# EAGLE schematic axiom_beta_main_board_v0.27_test.fcc74ab7 (EAGLE 7.7.0)

## Sheet 1 of 6
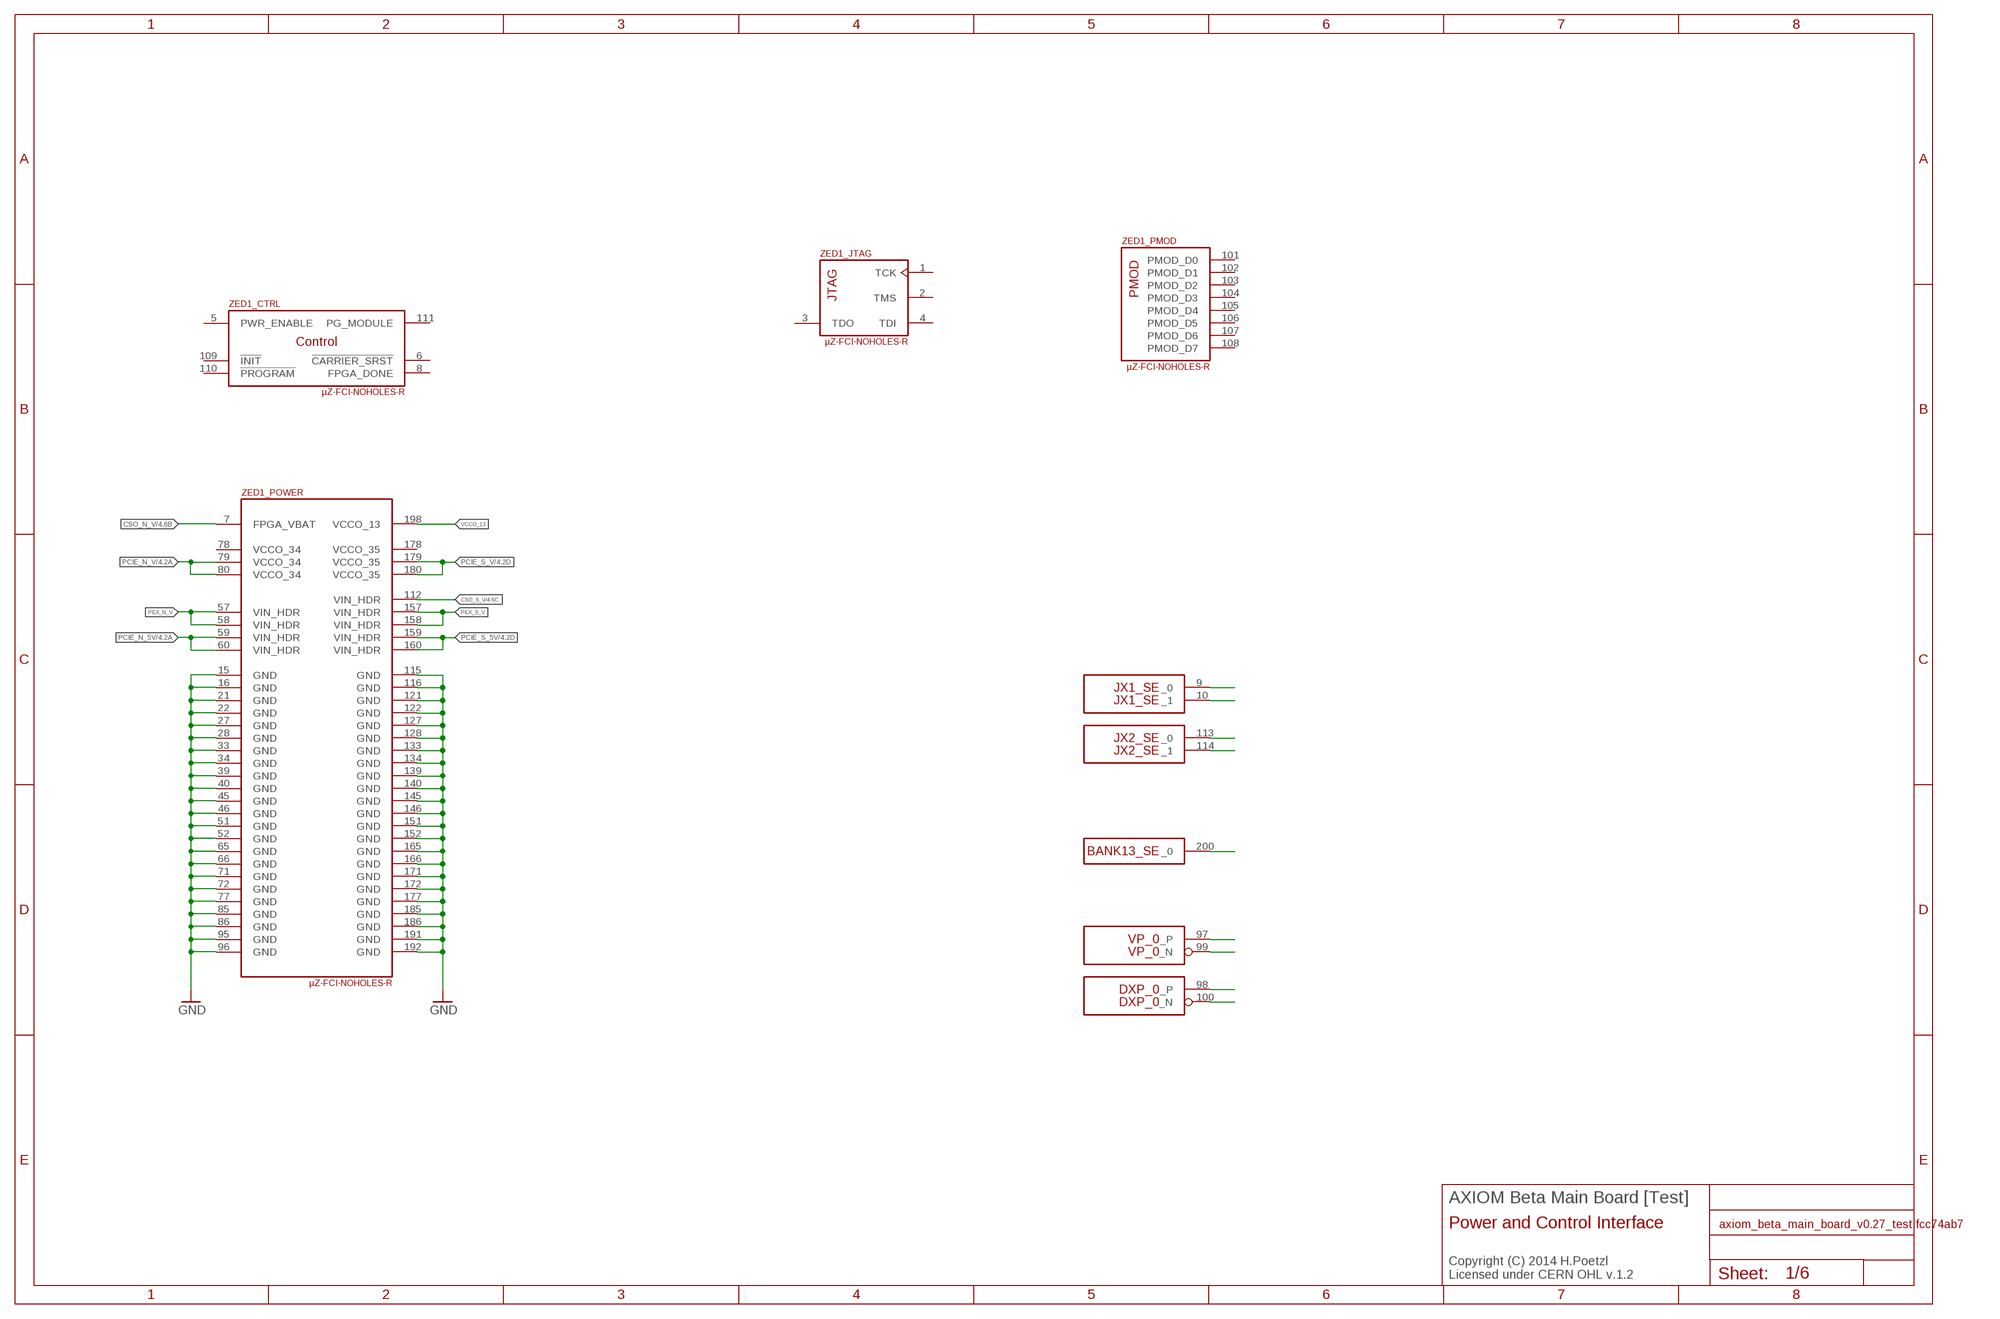
[diagram p0: schematic, sheet 1]

### Parts
ZED1  µZ-FCI-NOHOLES-R  [µZ-NOHOLES-R]

### Nets
CSO_N_V [power]: ZED1.7(_POWER:FPGA_VBAT) ; also sheet 4
CSO_S_V [power]: ZED1.112(_POWER:VIN_HDR) ; also sheet 4
GND: ZED1.15(_POWER:GND) ZED1.16(_POWER:GND) ZED1.21(_POWER:GND) ZED1.22(_POWER:GND) ZED1.27(_POWER:GND) ZED1.28(_POWER:GND) ZED1.33(_POWER:GND) ZED1.34(_POWER:GND) ZED1.39(_POWER:GND) ZED1.40(_POWER:GND) ZED1.45(_POWER:GND) ZED1.46(_POWER:GND) ZED1.51(_POWER:GND) ZED1.52(_POWER:GND) ZED1.65(_POWER:GND) ZED1.66(_POWER:GND) ZED1.71(_POWER:GND) ZED1.72(_POWER:GND) ZED1.77(_POWER:GND) ZED1.85(_POWER:GND) ZED1.86(_POWER:GND) ZED1.95(_POWER:GND) ZED1.96(_POWER:GND) ZED1.115(_POWER:GND) ZED1.116(_POWER:GND) ZED1.121(_POWER:GND) ZED1.122(_POWER:GND) ZED1.127(_POWER:GND) ZED1.128(_POWER:GND) ZED1.133(_POWER:GND) ZED1.134(_POWER:GND) ZED1.139(_POWER:GND) ZED1.140(_POWER:GND) ZED1.145(_POWER:GND) ZED1.146(_POWER:GND) ZED1.151(_POWER:GND) ZED1.152(_POWER:GND) ZED1.165(_POWER:GND) ZED1.166(_POWER:GND) ZED1.171(_POWER:GND) ZED1.172(_POWER:GND) ZED1.177(_POWER:GND) ZED1.185(_POWER:GND) ZED1.186(_POWER:GND) ZED1.191(_POWER:GND) ZED1.192(_POWER:GND) ; also sheet 3,4,5,6
N$1: ZED1.9(JX1_SE:_0)
N$46: ZED1.10(JX1_SE:_1)
N$47: ZED1.113(JX2_SE:_0)
N$48: ZED1.114(JX2_SE:_1)
N$49: ZED1.200(BANK13_SE:_0)
N$50: ZED1.97(VP_0:_P)
N$51: ZED1.99(VP_0:_N)
N$52: ZED1.98(DXP_0:_P)
N$53: ZED1.100(DXP_0:_N)
PCIE_N_5V: ZED1.59(_POWER:VIN_HDR) ZED1.60(_POWER:VIN_HDR) ; also sheet 4
PCIE_N_V: ZED1.79(_POWER:VCCO_34) ZED1.80(_POWER:VCCO_34) ; also sheet 4
PCIE_S_5V: ZED1.159(_POWER:VIN_HDR) ZED1.160(_POWER:VIN_HDR) ; also sheet 4
PCIE_S_V: ZED1.179(_POWER:VCCO_35) ZED1.180(_POWER:VCCO_35) ; also sheet 4
PEX_N_V [power]: ZED1.57(_POWER:VIN_HDR) ZED1.58(_POWER:VIN_HDR)
PEX_S_V [power]: ZED1.157(_POWER:VIN_HDR) ZED1.158(_POWER:VIN_HDR)
VCCO_13 [power]: ZED1.198(_POWER:VCCO_13)
Unconnected: ZED1.1(_JTAG:TCK) ZED1.2(_JTAG:TMS) ZED1.3(_JTAG:TDO) ZED1.4(_JTAG:TDI) ZED1.5(_CTRL:PWR_ENABLE) ZED1.6(_CTRL:!CARRIER_SRST) ZED1.8(_CTRL:FPGA_DONE) ZED1.101(_PMOD:PMOD_D0) ZED1.102(_PMOD:PMOD_D1) ZED1.103(_PMOD:PMOD_D2) ZED1.104(_PMOD:PMOD_D3) ZED1.105(_PMOD:PMOD_D4) ZED1.106(_PMOD:PMOD_D5) ZED1.107(_PMOD:PMOD_D6) ZED1.108(_PMOD:PMOD_D7) ZED1.109(_CTRL:!INIT) ZED1.110(_CTRL:!PROGRAM) ZED1.111(_CTRL:PG_MODULE)

### Notes on the sheet
- AXIOM Beta Main Board [Test]
- Power and Control Interface
- Copyright (C) 2014 H.Poetzl
  Licensed under CERN OHL v.1.2

## Sheet 2 of 6
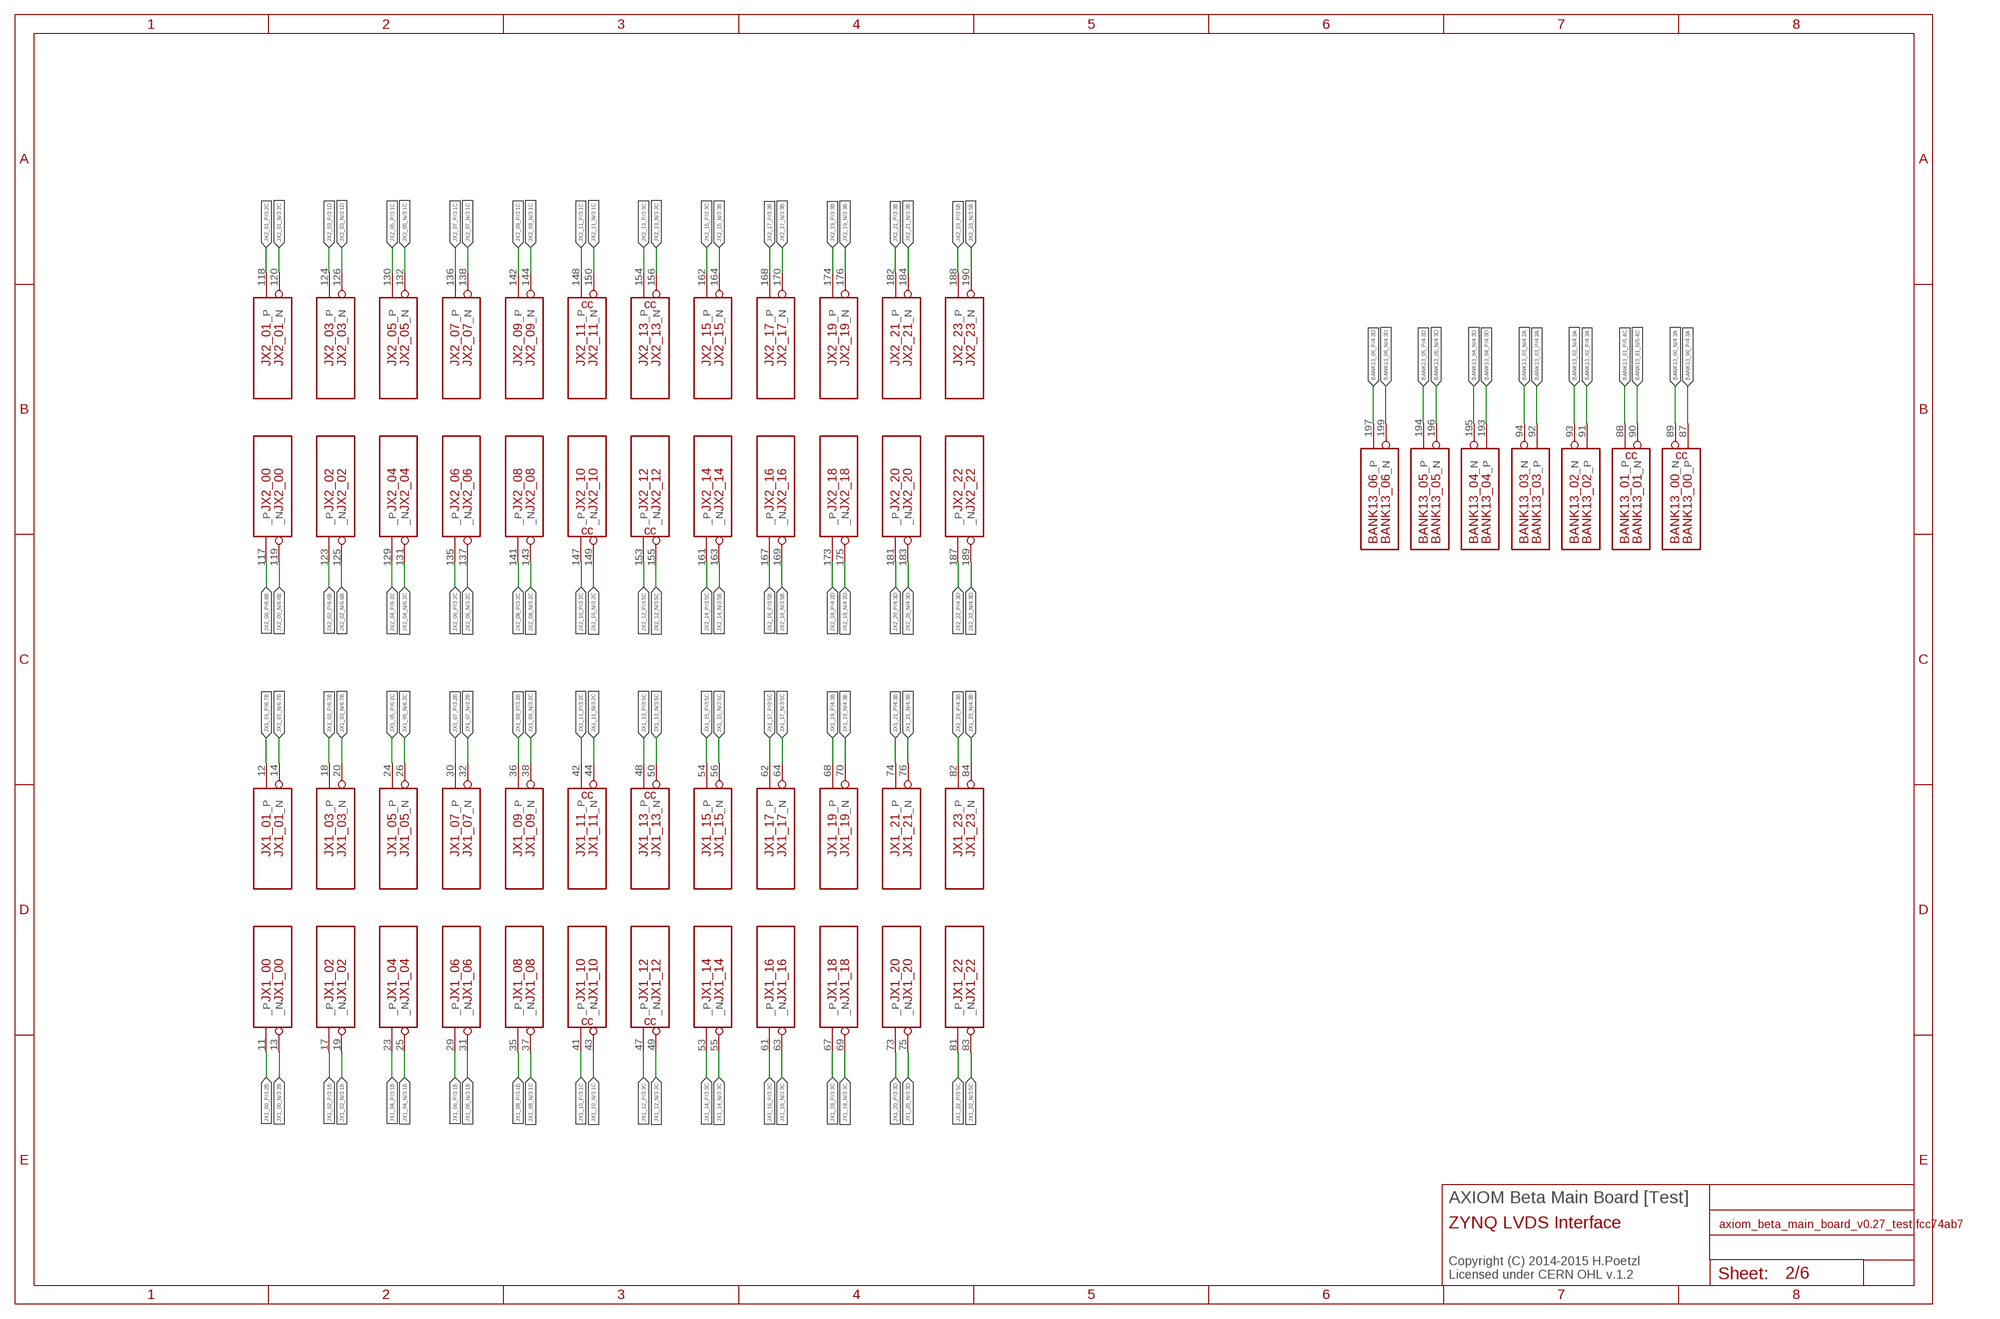
[diagram p1: schematic, sheet 2]

### Nets
BANK13_00_N [power]: ZED1.89(BANK13_00:_N) ; also sheet 4
BANK13_00_P [power]: ZED1.87(BANK13_00:_P) ; also sheet 4
BANK13_01_N [power]: ZED1.90(BANK13_01:_N) ; also sheet 5
BANK13_01_P [power]: ZED1.88(BANK13_01:_P) ; also sheet 5
BANK13_02_N [power]: ZED1.93(BANK13_02:_N) ; also sheet 4
BANK13_02_P [power]: ZED1.91(BANK13_02:_P) ; also sheet 4
BANK13_03_N [power]: ZED1.94(BANK13_03:_N) ; also sheet 4
BANK13_03_P [power]: ZED1.92(BANK13_03:_P) ; also sheet 4
BANK13_04_N [power]: ZED1.195(BANK13_04:_N) ; also sheet 4
BANK13_04_P [power]: ZED1.193(BANK13_04:_P) ; also sheet 4
BANK13_05_N: ZED1.196(BANK13_05:_N) ; also sheet 4
BANK13_05_P: ZED1.194(BANK13_05:_P) ; also sheet 4
BANK13_06_N [power]: ZED1.199(BANK13_06:_N) ; also sheet 4
BANK13_06_P [power]: ZED1.197(BANK13_06:_P) ; also sheet 4
JX1_00_N [power]: ZED1.13(JX1_00:_N) ; also sheet 3
JX1_00_P [power]: ZED1.11(JX1_00:_P) ; also sheet 3
JX1_01_N [power]: ZED1.14(JX1_01:_N) ; also sheet 6
JX1_01_P [power]: ZED1.12(JX1_01:_P) ; also sheet 6
JX1_02_N [power]: ZED1.19(JX1_02:_N) ; also sheet 3
JX1_02_P [power]: ZED1.17(JX1_02:_P) ; also sheet 3
JX1_03_N [power]: ZED1.20(JX1_03:_N) ; also sheet 6
JX1_03_P [power]: ZED1.18(JX1_03:_P) ; also sheet 6
JX1_04_N [power]: ZED1.25(JX1_04:_N) ; also sheet 3
JX1_04_P [power]: ZED1.23(JX1_04:_P) ; also sheet 3
JX1_05_N: ZED1.26(JX1_05:_N) ; also sheet 6
JX1_05_P: ZED1.24(JX1_05:_P) ; also sheet 6
JX1_06_N [power]: ZED1.31(JX1_06:_N) ; also sheet 3
JX1_06_P [power]: ZED1.29(JX1_06:_P) ; also sheet 3
JX1_07_N [power]: ZED1.32(JX1_07:_N) ; also sheet 3
JX1_07_P [power]: ZED1.30(JX1_07:_P) ; also sheet 3
JX1_08_N: ZED1.37(JX1_08:_N) ; also sheet 3
JX1_08_P: ZED1.35(JX1_08:_P) ; also sheet 3
JX1_09_N [power]: ZED1.38(JX1_09:_N) ; also sheet 3
JX1_09_P [power]: ZED1.36(JX1_09:_P) ; also sheet 3
JX1_10_N [power]: ZED1.43(JX1_10:_N) ; also sheet 3
JX1_10_P [power]: ZED1.41(JX1_10:_P) ; also sheet 3
JX1_11_N [power]: ZED1.44(JX1_11:_N) ; also sheet 3
JX1_11_P [power]: ZED1.42(JX1_11:_P) ; also sheet 3
JX1_12_N [power]: ZED1.49(JX1_12:_N) ; also sheet 3
JX1_12_P [power]: ZED1.47(JX1_12:_P) ; also sheet 3
JX1_13_N [power]: ZED1.50(JX1_13:_N) ; also sheet 3
JX1_13_P [power]: ZED1.48(JX1_13:_P) ; also sheet 3
JX1_14_N [power]: ZED1.55(JX1_14:_N) ; also sheet 3
JX1_14_P [power]: ZED1.53(JX1_14:_P) ; also sheet 3
JX1_15_N: ZED1.56(JX1_15:_N) ; also sheet 3
JX1_15_P: ZED1.54(JX1_15:_P) ; also sheet 3
JX1_16_N [power]: ZED1.63(JX1_16:_N) ; also sheet 3
JX1_16_P [power]: ZED1.61(JX1_16:_P) ; also sheet 3
JX1_17_N [power]: ZED1.64(JX1_17:_N) ; also sheet 3
JX1_17_P [power]: ZED1.62(JX1_17:_P) ; also sheet 3
JX1_18_N [power]: ZED1.69(JX1_18:_N) ; also sheet 3
JX1_18_P [power]: ZED1.67(JX1_18:_P) ; also sheet 3
JX1_19_N [power]: ZED1.70(JX1_19:_N) ; also sheet 4
JX1_19_P [power]: ZED1.68(JX1_19:_P) ; also sheet 4
JX1_20_N: ZED1.75(JX1_20:_N) ; also sheet 3
JX1_20_P: ZED1.73(JX1_20:_P) ; also sheet 3
JX1_21_N: ZED1.76(JX1_21:_N) ; also sheet 4
JX1_21_P: ZED1.74(JX1_21:_P) ; also sheet 4
JX1_22_N: ZED1.83(JX1_22:_N) ; also sheet 3
JX1_22_P: ZED1.81(JX1_22:_P) ; also sheet 3
JX1_23_N [power]: ZED1.84(JX1_23:_N) ; also sheet 4
JX1_23_P [power]: ZED1.82(JX1_23:_P) ; also sheet 4
JX2_00_N [power]: ZED1.119(JX2_00:_N) ; also sheet 6
JX2_00_P [power]: ZED1.117(JX2_00:_P) ; also sheet 6
JX2_01_N [power]: ZED1.120(JX2_01:_N) ; also sheet 3
JX2_01_P [power]: ZED1.118(JX2_01:_P) ; also sheet 3
JX2_02_N [power]: ZED1.125(JX2_02:_N) ; also sheet 6
JX2_02_P [power]: ZED1.123(JX2_02:_P) ; also sheet 6
JX2_03_N [power]: ZED1.126(JX2_03:_N) ; also sheet 3
JX2_03_P [power]: ZED1.124(JX2_03:_P) ; also sheet 3
JX2_04_N [power]: ZED1.131(JX2_04:_N) ; also sheet 6
JX2_04_P [power]: ZED1.129(JX2_04:_P) ; also sheet 6
JX2_05_N [power]: ZED1.132(JX2_05:_N) ; also sheet 3
JX2_05_P [power]: ZED1.130(JX2_05:_P) ; also sheet 3
JX2_06_N [power]: ZED1.137(JX2_06:_N) ; also sheet 3
JX2_06_P [power]: ZED1.135(JX2_06:_P) ; also sheet 3
JX2_07_N [power]: ZED1.138(JX2_07:_N) ; also sheet 3
JX2_07_P [power]: ZED1.136(JX2_07:_P) ; also sheet 3
JX2_08_N [power]: ZED1.143(JX2_08:_N) ; also sheet 3
JX2_08_P [power]: ZED1.141(JX2_08:_P) ; also sheet 3
JX2_09_N [power]: ZED1.144(JX2_09:_N) ; also sheet 3
JX2_09_P [power]: ZED1.142(JX2_09:_P) ; also sheet 3
JX2_10_N [power]: ZED1.149(JX2_10:_N) ; also sheet 3
JX2_10_P [power]: ZED1.147(JX2_10:_P) ; also sheet 3
JX2_11_N [power]: ZED1.150(JX2_11:_N) ; also sheet 3
JX2_11_P [power]: ZED1.148(JX2_11:_P) ; also sheet 3
JX2_12_N [power]: ZED1.155(JX2_12:_N) ; also sheet 3
JX2_12_P [power]: ZED1.153(JX2_12:_P) ; also sheet 3
JX2_13_N [power]: ZED1.156(JX2_13:_N) ; also sheet 3
JX2_13_P [power]: ZED1.154(JX2_13:_P) ; also sheet 3
JX2_14_N: ZED1.163(JX2_14:_N) ; also sheet 3
JX2_14_P: ZED1.161(JX2_14:_P) ; also sheet 3
JX2_15_N [power]: ZED1.164(JX2_15:_N) ; also sheet 3
JX2_15_P [power]: ZED1.162(JX2_15:_P) ; also sheet 3
JX2_16_N [power]: ZED1.169(JX2_16:_N) ; also sheet 3
JX2_16_P [power]: ZED1.167(JX2_16:_P) ; also sheet 3
JX2_17_N [power]: ZED1.170(JX2_17:_N) ; also sheet 3
JX2_17_P [power]: ZED1.168(JX2_17:_P) ; also sheet 3
JX2_18_N [power]: ZED1.175(JX2_18:_N) ; also sheet 4
JX2_18_P [power]: ZED1.173(JX2_18:_P) ; also sheet 4
JX2_19_N [power]: ZED1.176(JX2_19:_N) ; also sheet 3
JX2_19_P [power]: ZED1.174(JX2_19:_P) ; also sheet 3
JX2_20_N [power]: ZED1.183(JX2_20:_N) ; also sheet 4
JX2_20_P [power]: ZED1.181(JX2_20:_P) ; also sheet 4
JX2_21_N [power]: ZED1.184(JX2_21:_N) ; also sheet 3
JX2_21_P [power]: ZED1.182(JX2_21:_P) ; also sheet 3
JX2_22_N: ZED1.189(JX2_22:_N) ; also sheet 4
JX2_22_P: ZED1.187(JX2_22:_P) ; also sheet 4
JX2_23_N [power]: ZED1.190(JX2_23:_N) ; also sheet 3
JX2_23_P [power]: ZED1.188(JX2_23:_P) ; also sheet 3

### Notes on the sheet
- AXIOM Beta Main Board [Test]
- ZYNQ LVDS Interface
- Copyright (C) 2014-2015 H.Poetzl
  Licensed under CERN OHL v.1.2

## Sheet 3 of 6
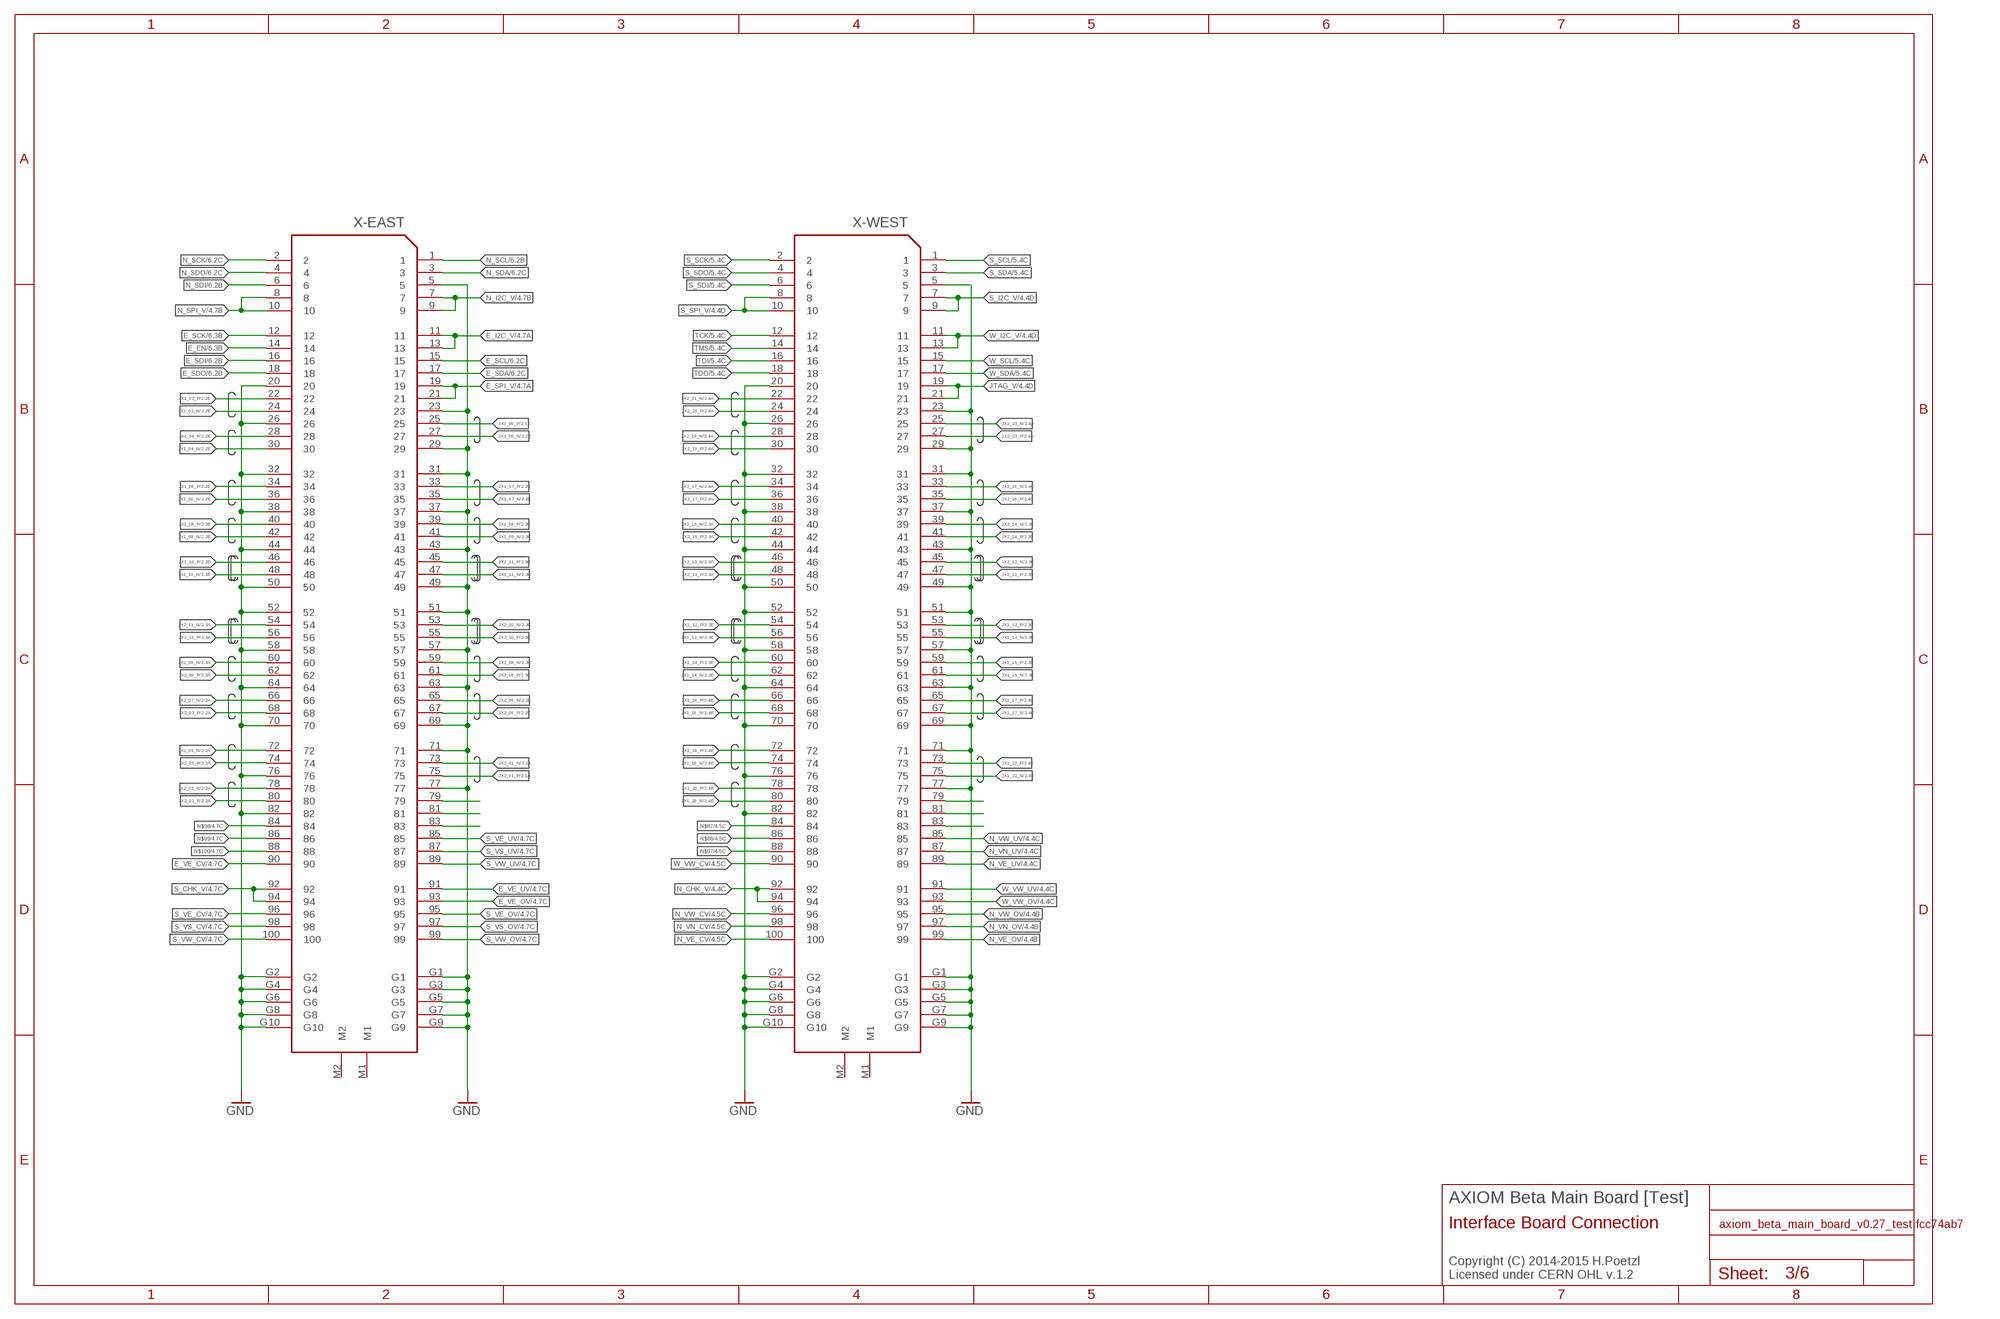
[diagram p2: schematic, sheet 3]

### Parts
X-EAST  FX10-100/10S  [FX10A-100S/10]
X-WEST  FX10-100/10S  [FX10A-100S/10]

### Nets
E_EN: X-EAST.14 ; also sheet 6
E_I2C_V: X-EAST.11 X-EAST.13 ; also sheet 4
E_SCK: X-EAST.12 ; also sheet 6
E_SCL: X-EAST.15 ; also sheet 6
E_SDA: X-EAST.17 ; also sheet 6
E_SDI: X-EAST.16 ; also sheet 6
E_SDO: X-EAST.18 ; also sheet 6
E_SPI_V: X-EAST.19 X-EAST.21 ; also sheet 4
E_VE_CV: X-EAST.90 ; also sheet 4
E_VE_OV: X-EAST.93 ; also sheet 4
E_VE_UV: X-EAST.91 ; also sheet 4
GND: X-EAST.5 X-EAST.20 X-EAST.23 X-EAST.26 X-EAST.29 X-EAST.31 X-EAST.32 X-EAST.37 X-EAST.38 X-EAST.43 X-EAST.44 X-EAST.49 X-EAST.50 X-EAST.51 X-EAST.52 X-EAST.57 X-EAST.58 X-EAST.63 X-EAST.64 X-EAST.69 X-EAST.70 X-EAST.71 X-EAST.76 X-EAST.77 X-EAST.82 X-EAST.G1 X-EAST.G2 X-EAST.G3 X-EAST.G4 X-EAST.G5 X-EAST.G6 X-EAST.G7 X-EAST.G8 X-EAST.G9 X-EAST.G10 X-WEST.5 X-WEST.20 X-WEST.23 X-WEST.26 X-WEST.29 X-WEST.31 X-WEST.32 X-WEST.37 X-WEST.38 X-WEST.43 X-WEST.44 X-WEST.49 X-WEST.50 X-WEST.51 X-WEST.52 X-WEST.57 X-WEST.58 X-WEST.63 X-WEST.64 X-WEST.69 X-WEST.70 X-WEST.71 X-WEST.76 X-WEST.77 X-WEST.82 X-WEST.G1 X-WEST.G2 X-WEST.G3 X-WEST.G4 X-WEST.G5 X-WEST.G6 X-WEST.G7 X-WEST.G8 X-WEST.G9 X-WEST.G10 ; also sheet 1,4,5,6
JTAG_V: X-WEST.19 X-WEST.21 ; also sheet 4
JX1_00_N [power]: X-EAST.27 ; also sheet 2
JX1_00_P [power]: X-EAST.25 ; also sheet 2
JX1_02_N [power]: X-EAST.24 ; also sheet 2
JX1_02_P [power]: X-EAST.22 ; also sheet 2
JX1_04_N [power]: X-EAST.30 ; also sheet 2
JX1_04_P [power]: X-EAST.28 ; also sheet 2
JX1_06_N [power]: X-EAST.36 ; also sheet 2
JX1_06_P [power]: X-EAST.34 ; also sheet 2
JX1_07_N [power]: X-EAST.35 ; also sheet 2
JX1_07_P [power]: X-EAST.33 ; also sheet 2
JX1_08_N: X-EAST.42 ; also sheet 2
JX1_08_P: X-EAST.40 ; also sheet 2
JX1_09_N [power]: X-EAST.41 ; also sheet 2
JX1_09_P [power]: X-EAST.39 ; also sheet 2
JX1_10_N [power]: X-EAST.48 ; also sheet 2
JX1_10_P [power]: X-EAST.46 ; also sheet 2
JX1_11_N [power]: X-EAST.47 ; also sheet 2
JX1_11_P [power]: X-EAST.45 ; also sheet 2
JX1_12_N [power]: X-WEST.56 ; also sheet 2
JX1_12_P [power]: X-WEST.54 ; also sheet 2
JX1_13_N [power]: X-WEST.55 ; also sheet 2
JX1_13_P [power]: X-WEST.53 ; also sheet 2
JX1_14_N [power]: X-WEST.62 ; also sheet 2
JX1_14_P [power]: X-WEST.60 ; also sheet 2
JX1_15_N: X-WEST.61 ; also sheet 2
JX1_15_P: X-WEST.59 ; also sheet 2
JX1_16_N [power]: X-WEST.68 ; also sheet 2
JX1_16_P [power]: X-WEST.66 ; also sheet 2
JX1_17_N [power]: X-WEST.67 ; also sheet 2
JX1_17_P [power]: X-WEST.65 ; also sheet 2
JX1_18_N [power]: X-WEST.74 ; also sheet 2
JX1_18_P [power]: X-WEST.72 ; also sheet 2
JX1_20_N: X-WEST.80 ; also sheet 2
JX1_20_P: X-WEST.78 ; also sheet 2
JX1_22_N: X-WEST.75 ; also sheet 2
JX1_22_P: X-WEST.73 ; also sheet 2
JX2_01_N [power]: X-EAST.73 ; also sheet 2
JX2_01_P [power]: X-EAST.75 ; also sheet 2
JX2_03_N [power]: X-EAST.78 ; also sheet 2
JX2_03_P [power]: X-EAST.80 ; also sheet 2
JX2_05_N [power]: X-EAST.72 ; also sheet 2
JX2_05_P [power]: X-EAST.74 ; also sheet 2
JX2_06_N [power]: X-EAST.65 ; also sheet 2
JX2_06_P [power]: X-EAST.67 ; also sheet 2
JX2_07_N [power]: X-EAST.66 ; also sheet 2
JX2_07_P [power]: X-EAST.68 ; also sheet 2
JX2_08_N [power]: X-EAST.59 ; also sheet 2
JX2_08_P [power]: X-EAST.61 ; also sheet 2
JX2_09_N [power]: X-EAST.60 ; also sheet 2
JX2_09_P [power]: X-EAST.62 ; also sheet 2
JX2_10_N [power]: X-EAST.53 ; also sheet 2
JX2_10_P [power]: X-EAST.55 ; also sheet 2
JX2_11_N [power]: X-EAST.54 ; also sheet 2
JX2_11_P [power]: X-EAST.56 ; also sheet 2
JX2_12_N [power]: X-WEST.45 ; also sheet 2
JX2_12_P [power]: X-WEST.47 ; also sheet 2
JX2_13_N [power]: X-WEST.46 ; also sheet 2
JX2_13_P [power]: X-WEST.48 ; also sheet 2
JX2_14_N: X-WEST.39 ; also sheet 2
JX2_14_P: X-WEST.41 ; also sheet 2
JX2_15_N [power]: X-WEST.40 ; also sheet 2
JX2_15_P [power]: X-WEST.42 ; also sheet 2
JX2_16_N [power]: X-WEST.33 ; also sheet 2
JX2_16_P [power]: X-WEST.35 ; also sheet 2
JX2_17_N [power]: X-WEST.34 ; also sheet 2
JX2_17_P [power]: X-WEST.36 ; also sheet 2
JX2_19_N [power]: X-WEST.28 ; also sheet 2
JX2_19_P [power]: X-WEST.30 ; also sheet 2
JX2_21_N [power]: X-WEST.22 ; also sheet 2
JX2_21_P [power]: X-WEST.24 ; also sheet 2
JX2_23_N [power]: X-WEST.25 ; also sheet 2
JX2_23_P [power]: X-WEST.27 ; also sheet 2
N$6: X-EAST.79
N$7: X-EAST.81
N$11: X-EAST.83
N$54: X-WEST.79
N$61: X-WEST.81
N$86: X-WEST.83
N$87: X-WEST.84 ; also sheet 4
N$88: X-WEST.86 ; also sheet 4
N$97: X-WEST.88 ; also sheet 4
N$98: X-EAST.84 ; also sheet 4
N$99: X-EAST.86 ; also sheet 4
N$100: X-EAST.88 ; also sheet 4
N_CHK_V: X-WEST.92 X-WEST.94 ; also sheet 4
N_I2C_V: X-EAST.7 X-EAST.9 ; also sheet 4
N_SCK: X-EAST.2 ; also sheet 6
N_SCL: X-EAST.1 ; also sheet 6
N_SDA: X-EAST.3 ; also sheet 6
N_SDI: X-EAST.6 ; also sheet 6
N_SDO: X-EAST.4 ; also sheet 6
N_SPI_V: X-EAST.8 X-EAST.10 ; also sheet 4
N_VE_CV: X-WEST.100 ; also sheet 4
N_VE_OV: X-WEST.99 ; also sheet 4
N_VE_UV: X-WEST.89 ; also sheet 4
N_VN_CV: X-WEST.98 ; also sheet 4
N_VN_OV: X-WEST.97 ; also sheet 4
N_VN_UV: X-WEST.87 ; also sheet 4
N_VW_CV: X-WEST.96 ; also sheet 4
N_VW_OV: X-WEST.95 ; also sheet 4
N_VW_UV: X-WEST.85 ; also sheet 4
S_CHK_V: X-EAST.92 X-EAST.94 ; also sheet 4
S_I2C_V: X-WEST.7 X-WEST.9 ; also sheet 4
S_SCK: X-WEST.2 ; also sheet 5
S_SCL: X-WEST.1 ; also sheet 5
S_SDA: X-WEST.3 ; also sheet 5
S_SDI: X-WEST.6 ; also sheet 5
S_SDO: X-WEST.4 ; also sheet 5
S_SPI_V: X-WEST.8 X-WEST.10 ; also sheet 4
S_VE_CV: X-EAST.96 ; also sheet 4
S_VE_OV: X-EAST.95 ; also sheet 4
S_VE_UV: X-EAST.85 ; also sheet 4
S_VS_CV: X-EAST.98 ; also sheet 4
S_VS_OV: X-EAST.97 ; also sheet 4
S_VS_UV: X-EAST.87 ; also sheet 4
S_VW_CV: X-EAST.100 ; also sheet 4
S_VW_OV: X-EAST.99 ; also sheet 4
S_VW_UV: X-EAST.89 ; also sheet 4
TCK: X-WEST.12 ; also sheet 5
TDI: X-WEST.16 ; also sheet 5
TDO: X-WEST.18 ; also sheet 5
TMS: X-WEST.14 ; also sheet 5
W_I2C_V: X-WEST.11 X-WEST.13 ; also sheet 4
W_SCL: X-WEST.15 ; also sheet 5
W_SDA: X-WEST.17 ; also sheet 5
W_VW_CV: X-WEST.90 ; also sheet 4
W_VW_OV: X-WEST.93 ; also sheet 4
W_VW_UV: X-WEST.91 ; also sheet 4
Unconnected: X-EAST.M1 X-EAST.M2 X-WEST.M1 X-WEST.M2

### Notes on the sheet
- AXIOM Beta Main Board [Test]
- Interface Board Connection
- Copyright (C) 2014-2015 H.Poetzl
  Licensed under CERN OHL v.1.2

## Sheet 4 of 6
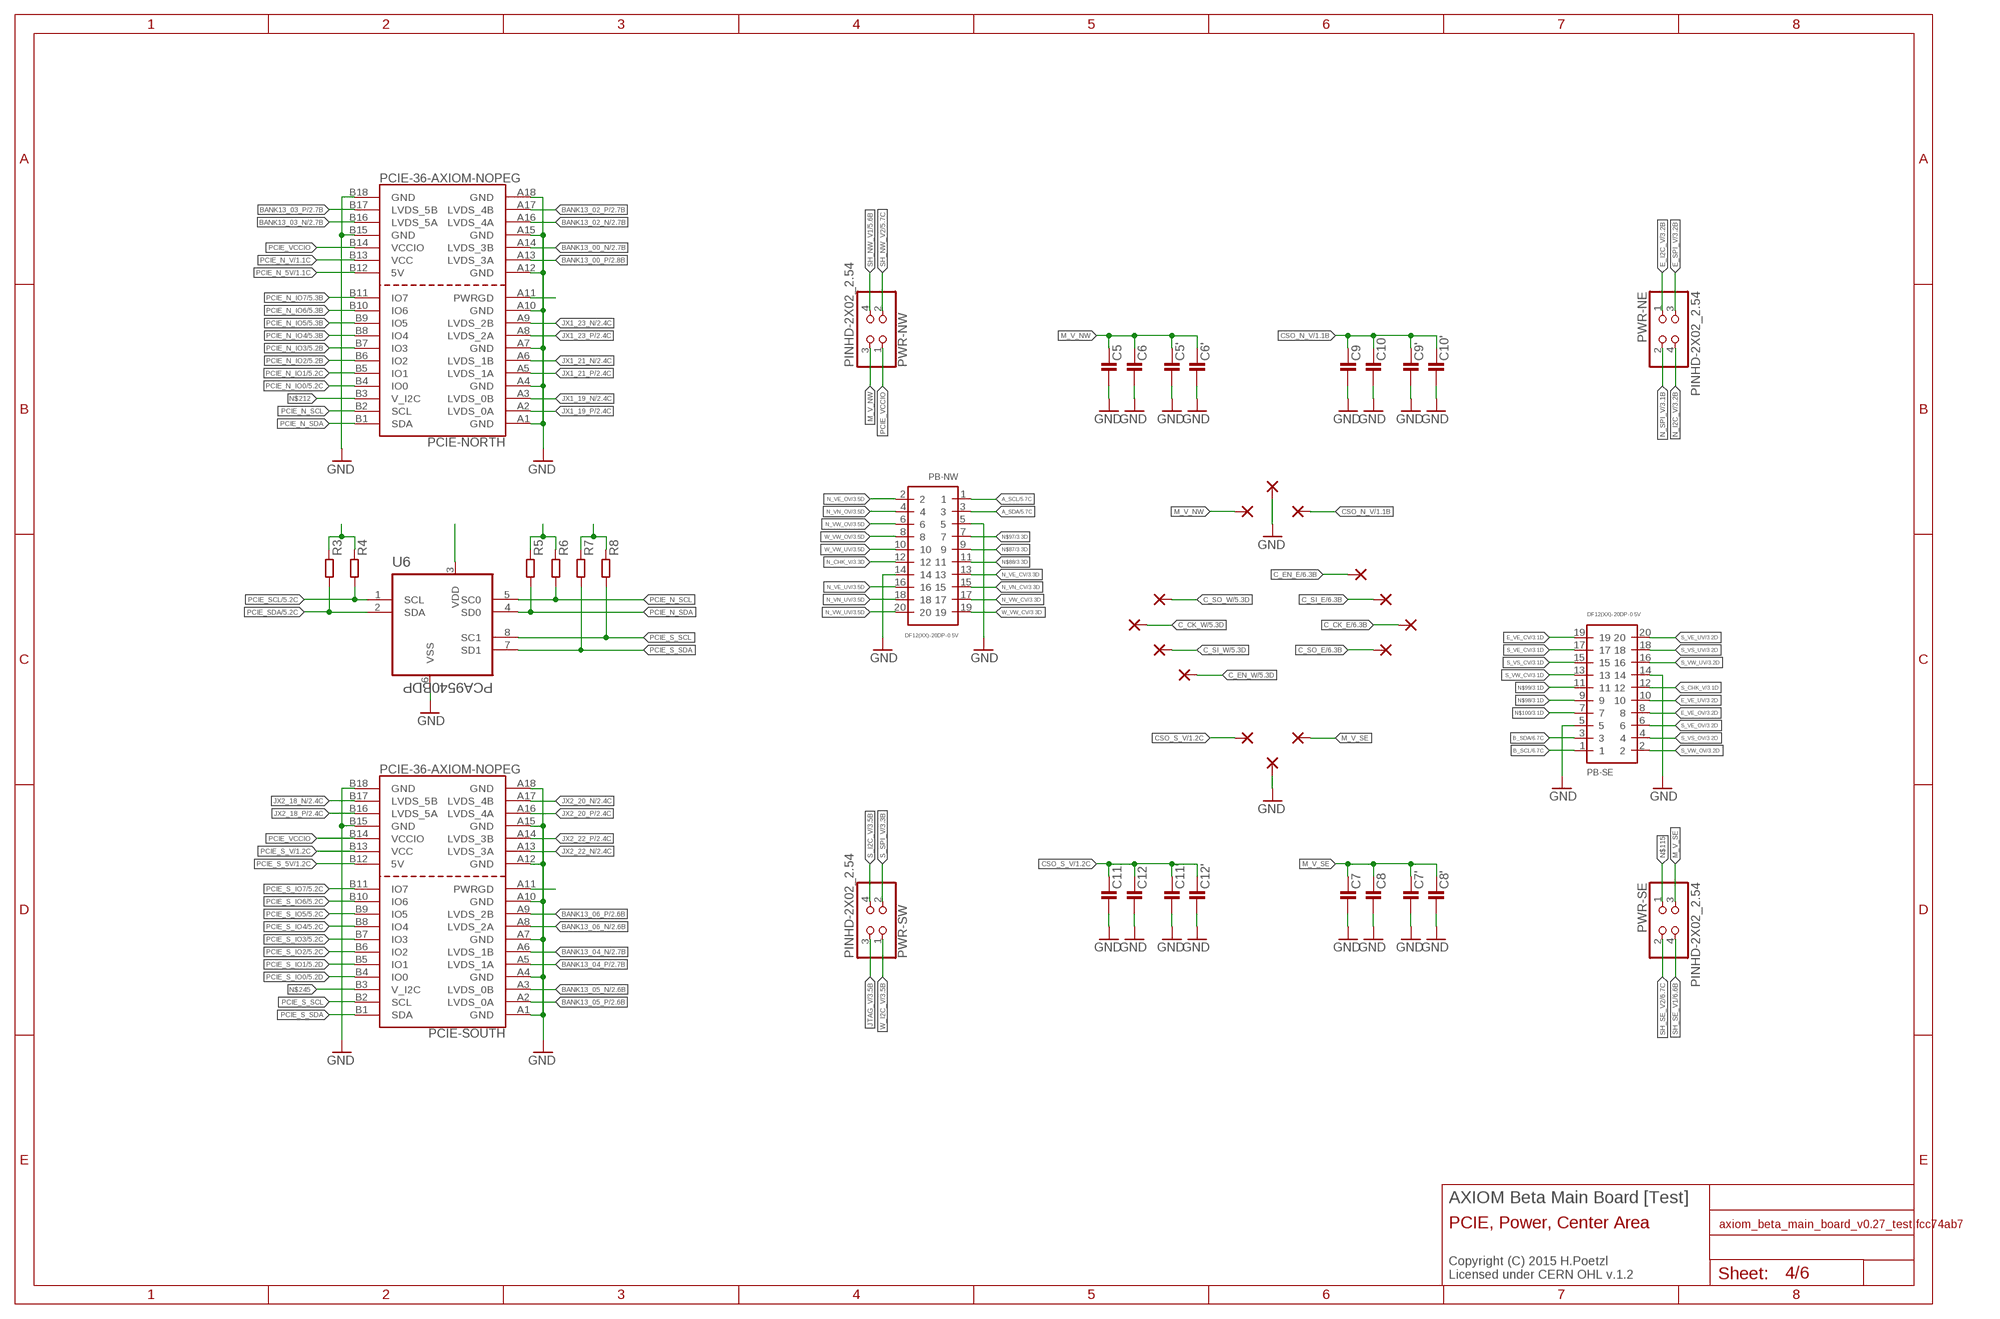
[diagram p3: schematic, sheet 4]

### Parts
C5  C0805-A  [0805-A]
C5'  C0805-A  [0805-A]
C6  C0603-A  [0603-A]
C6'  C0603-A  [0603-A]
C7  C0805-A  [0805-A]
C7'  C0805-A  [0805-A]
C8  C0603-A  [0603-A]
C8'  C0603-A  [0603-A]
C9  C0805-A  [0805-A]
C9'  C0805-A  [0805-A]
C10  C0603-A  [0603-A]
C10'  C0603-A  [0603-A]
C11  C0805-A  [0805-A]
C11'  C0805-A  [0805-A]
C12  C0603-A  [0603-A]
C12'  C0603-A  [0603-A]
PB-NW  DF12(XX)-20DP-0.5V  [DF12(XX)-20DP-0.5V]
PB-SE  DF12(XX)-20DP-0.5V  [DF12(XX)-20DP-0.5V]
PCIE-NORTH  PCIE-36-AXIOM-NOPEG  [PCIE-36-NOPEG]
PCIE-SOUTH  PCIE-36-AXIOM-NOPEG  [PCIE-36-NOPEG]
PWR-NE  PINHD-2X02_2.54  [2X02]
PWR-NW  PINHD-2X02_2.54  [2X02]
PWR-SE  PINHD-2X02_2.54  [2X02]
PWR-SW  PINHD-2X02_2.54  [2X02]
R3  R0402-B  [0402-B]
R4  R0402-B  [0402-B]
R5  R0402-B  [0402-B]
R6  R0402-B  [0402-B]
R7  R0402-B  [0402-B]
R8  R0402-B  [0402-B]
U6  PCA9540BDP  [SOP65P490X110-8N]
U$1  PINPAD1.27MM  [1.2/0.6]
U$2  PINPAD1.27MM  [1.2/0.6]
U$3  PINPAD1.27MM  [1.2/0.6]
U$4  PINPAD1.27MM  [1.2/0.6]
U$11  PINPAD1.27MM  [1.2/0.6]
U$14  PINPAD1.27MM  [1.2/0.6]
U$15  PINPAD1.27MM  [1.2/0.6]
U$16  PINPAD1.27MM  [1.2/0.6]
U$17  PINPAD1.27MM  [1.2/0.6]
U$18  PINPAD1.27MM  [1.2/0.6]
U$19  PINPAD1.27MM  [1.2/0.6]
U$20  PINPAD1.27MM  [1.2/0.6]
U$21  PINPAD1.27MM  [1.2/0.6]
U$22  PINPAD1.27MM  [1.2/0.6]

### Nets
A_SCL: PB-NW.1 ; also sheet 5
A_SDA: PB-NW.3 ; also sheet 5
B_SCL: PB-SE.1 ; also sheet 6
B_SDA: PB-SE.3 ; also sheet 6
BANK13_00_N [power]: PCIE-NORTH.A14(LVDS_3B) ; also sheet 2
BANK13_00_P [power]: PCIE-NORTH.A13(LVDS_3A) ; also sheet 2
BANK13_02_N [power]: PCIE-NORTH.A16(LVDS_4A) ; also sheet 2
BANK13_02_P [power]: PCIE-NORTH.A17(LVDS_4B) ; also sheet 2
BANK13_03_N [power]: PCIE-NORTH.B16(LVDS_5A) ; also sheet 2
BANK13_03_P [power]: PCIE-NORTH.B17(LVDS_5B) ; also sheet 2
BANK13_04_N [power]: PCIE-SOUTH.A6(LVDS_1B) ; also sheet 2
BANK13_04_P [power]: PCIE-SOUTH.A5(LVDS_1A) ; also sheet 2
BANK13_05_N: PCIE-SOUTH.A3(LVDS_0B) ; also sheet 2
BANK13_05_P: PCIE-SOUTH.A2(LVDS_0A) ; also sheet 2
BANK13_06_N [power]: PCIE-SOUTH.A8(LVDS_2A) ; also sheet 2
BANK13_06_P [power]: PCIE-SOUTH.A9(LVDS_2B) ; also sheet 2
C_CK_E: U$14.1(P) ; also sheet 6
C_CK_W: U$1.1(P) ; also sheet 5
C_EN_E: U$3.1(P) ; also sheet 6
C_EN_W: U$4.1(P) ; also sheet 5
C_SI_E: U$15.1(P) ; also sheet 6
C_SI_W: U$2.1(P) ; also sheet 5
C_SO_E: U$16.1(P) ; also sheet 6
C_SO_W: U$11.1(P) ; also sheet 5
CSO_N_V [power]: C9'.1 C9.1 C10'.1 C10.1 U$19.1(P) ; also sheet 1
CSO_S_V [power]: C11'.1 C11.1 C12'.1 C12.1 U$22.1(P) ; also sheet 1
E_I2C_V: PWR-NE.1 ; also sheet 3
E_SPI_V: PWR-NE.3 ; also sheet 3
E_VE_CV: PB-SE.19 ; also sheet 3
E_VE_OV: PB-SE.8 ; also sheet 3
E_VE_UV: PB-SE.10 ; also sheet 3
GND: C5'.2 C5.2 C6'.2 C6.2 C7'.2 C7.2 C8'.2 C8.2 C9'.2 C9.2 C10'.2 C10.2 C11'.2 C11.2 C12'.2 C12.2 PB-NW.5 PB-NW.14 PB-SE.5 PB-SE.14 PCIE-NORTH.A1(GND) PCIE-NORTH.A4(GND) PCIE-NORTH.A7(GND) PCIE-NORTH.A10(GND) PCIE-NORTH.A12(GND) PCIE-NORTH.A15(GND) PCIE-NORTH.A18(GND) PCIE-NORTH.B15(GND) PCIE-NORTH.B18(GND) PCIE-SOUTH.A1(GND) PCIE-SOUTH.A4(GND) PCIE-SOUTH.A7(GND) PCIE-SOUTH.A10(GND) PCIE-SOUTH.A12(GND) PCIE-SOUTH.A15(GND) PCIE-SOUTH.A18(GND) PCIE-SOUTH.B15(GND) PCIE-SOUTH.B18(GND) U6.6(VSS) U$17.1(P) U$20.1(P) ; also sheet 1,3,5,6
JTAG_V: PWR-SW.3 ; also sheet 3
JX1_19_N [power]: PCIE-NORTH.A3(LVDS_0B) ; also sheet 2
JX1_19_P [power]: PCIE-NORTH.A2(LVDS_0A) ; also sheet 2
JX1_21_N: PCIE-NORTH.A6(LVDS_1B) ; also sheet 2
JX1_21_P: PCIE-NORTH.A5(LVDS_1A) ; also sheet 2
JX1_23_N [power]: PCIE-NORTH.A9(LVDS_2B) ; also sheet 2
JX1_23_P [power]: PCIE-NORTH.A8(LVDS_2A) ; also sheet 2
JX2_18_N [power]: PCIE-SOUTH.B17(LVDS_5B) ; also sheet 2
JX2_18_P [power]: PCIE-SOUTH.B16(LVDS_5A) ; also sheet 2
JX2_20_N [power]: PCIE-SOUTH.A17(LVDS_4B) ; also sheet 2
JX2_20_P [power]: PCIE-SOUTH.A16(LVDS_4A) ; also sheet 2
JX2_22_N: PCIE-SOUTH.A13(LVDS_3A) ; also sheet 2
JX2_22_P: PCIE-SOUTH.A14(LVDS_3B) ; also sheet 2
M_V_NW: C5'.1 C5.1 C6'.1 C6.1 PWR-NW.3 U$18.1(P)
M_V_SE: C7'.1 C7.1 C8'.1 C8.1 PWR-SE.3 U$21.1(P)
N$87: PB-NW.9 ; also sheet 3
N$88: PB-NW.11 ; also sheet 3
N$97: PB-NW.7 ; also sheet 3
N$98: PB-SE.9 ; also sheet 3
N$99: PB-SE.11 ; also sheet 3
N$100: PB-SE.7 ; also sheet 3
N$115: PWR-SE.1
N$177: R3.1 R4.1
N$178: R5.1 R6.1
N$179: R7.1 R8.1
N$180: U6.3(VDD)
N$209: PCIE-SOUTH.A11(PWRGD)
N$212: PCIE-NORTH.B3(V_I2C)
N$245: PCIE-SOUTH.B3(V_I2C)
N$256: PCIE-NORTH.A11(PWRGD)
N_CHK_V: PB-NW.12 ; also sheet 3
N_I2C_V: PWR-NE.4 ; also sheet 3
N_SPI_V: PWR-NE.2 ; also sheet 3
N_VE_CV: PB-NW.13 ; also sheet 3
N_VE_OV: PB-NW.2 ; also sheet 3
N_VE_UV: PB-NW.16 ; also sheet 3
N_VN_CV: PB-NW.15 ; also sheet 3
N_VN_OV: PB-NW.4 ; also sheet 3
N_VN_UV: PB-NW.18 ; also sheet 3
N_VW_CV: PB-NW.17 ; also sheet 3
N_VW_OV: PB-NW.6 ; also sheet 3
N_VW_UV: PB-NW.20 ; also sheet 3
PCIE_N_5V: PCIE-NORTH.B12(5V) ; also sheet 1
PCIE_N_IO0: PCIE-NORTH.B4(IO0) ; also sheet 5
PCIE_N_IO1: PCIE-NORTH.B5(IO1) ; also sheet 5
PCIE_N_IO2: PCIE-NORTH.B6(IO2) ; also sheet 5
PCIE_N_IO3: PCIE-NORTH.B7(IO3) ; also sheet 5
PCIE_N_IO4: PCIE-NORTH.B8(IO4) ; also sheet 5
PCIE_N_IO5: PCIE-NORTH.B9(IO5) ; also sheet 5
PCIE_N_IO6: PCIE-NORTH.B10(IO6) ; also sheet 5
PCIE_N_IO7: PCIE-NORTH.B11(IO7) ; also sheet 5
PCIE_N_SCL: PCIE-NORTH.B2(SCL) R6.2 U6.5(SC0)
PCIE_N_SDA: PCIE-NORTH.B1(SDA) R5.2 U6.4(SD0)
PCIE_N_V: PCIE-NORTH.B13(VCC) ; also sheet 1
PCIE_S_5V: PCIE-SOUTH.B12(5V) ; also sheet 1
PCIE_S_IO0: PCIE-SOUTH.B4(IO0) ; also sheet 5
PCIE_S_IO1: PCIE-SOUTH.B5(IO1) ; also sheet 5
PCIE_S_IO2: PCIE-SOUTH.B6(IO2) ; also sheet 5
PCIE_S_IO3: PCIE-SOUTH.B7(IO3) ; also sheet 5
PCIE_S_IO4: PCIE-SOUTH.B8(IO4) ; also sheet 5
PCIE_S_IO5: PCIE-SOUTH.B9(IO5) ; also sheet 5
PCIE_S_IO6: PCIE-SOUTH.B10(IO6) ; also sheet 5
PCIE_S_IO7: PCIE-SOUTH.B11(IO7) ; also sheet 5
PCIE_S_SCL: PCIE-SOUTH.B2(SCL) R8.2 U6.8(SC1)
PCIE_S_SDA: PCIE-SOUTH.B1(SDA) R7.2 U6.7(SD1)
PCIE_S_V: PCIE-SOUTH.B13(VCC) ; also sheet 1
PCIE_SCL: R4.2 U6.1(SCL) ; also sheet 5
PCIE_SDA: R3.2 U6.2(SDA) ; also sheet 5
PCIE_VCCIO: PCIE-NORTH.B14(VCCIO) PCIE-SOUTH.B14(VCCIO) PWR-NW.1
S_CHK_V: PB-SE.12 ; also sheet 3
S_I2C_V: PWR-SW.4 ; also sheet 3
S_SPI_V: PWR-SW.2 ; also sheet 3
S_VE_CV: PB-SE.17 ; also sheet 3
S_VE_OV: PB-SE.6 ; also sheet 3
S_VE_UV: PB-SE.20 ; also sheet 3
S_VS_CV: PB-SE.15 ; also sheet 3
S_VS_OV: PB-SE.4 ; also sheet 3
S_VS_UV: PB-SE.18 ; also sheet 3
S_VW_CV: PB-SE.13 ; also sheet 3
S_VW_OV: PB-SE.2 ; also sheet 3
S_VW_UV: PB-SE.16 ; also sheet 3
SH_NW_V1: PWR-NW.4 ; also sheet 5
SH_NW_V2: PWR-NW.2 ; also sheet 5
SH_SE_V1: PWR-SE.4 ; also sheet 6
SH_SE_V2: PWR-SE.2 ; also sheet 6
W_I2C_V: PWR-SW.1 ; also sheet 3
W_VW_CV: PB-NW.19 ; also sheet 3
W_VW_OV: PB-NW.8 ; also sheet 3
W_VW_UV: PB-NW.10 ; also sheet 3

### Notes on the sheet
- AXIOM Beta Main Board [Test]
- PCIE, Power, Center Area
- Copyright (C) 2015 H.Poetzl
  Licensed under CERN OHL v.1.2

## Sheet 5 of 6
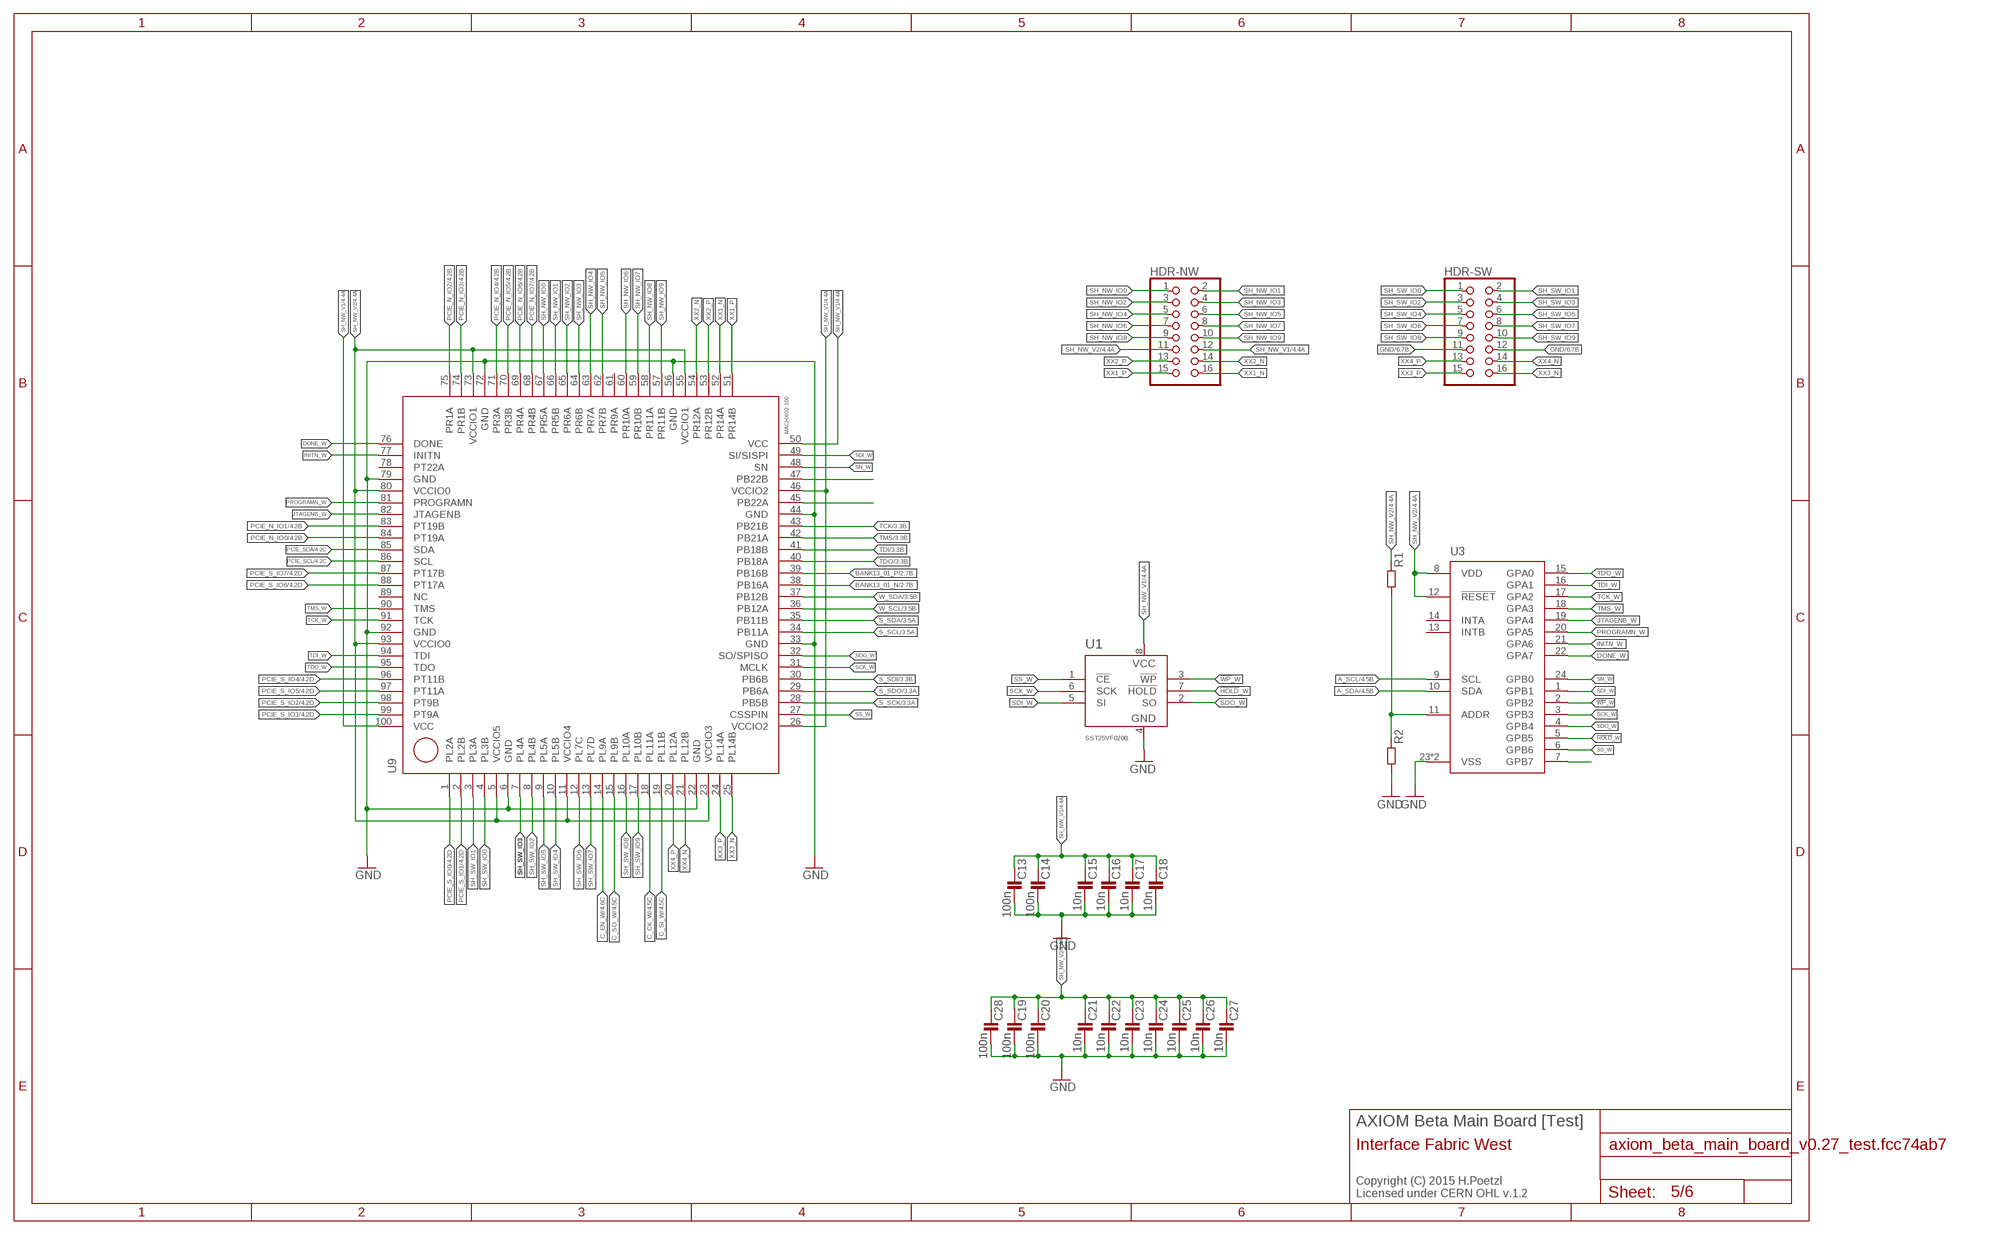
[diagram p4: schematic, sheet 5]

### Parts
C13  100n  C0402-B  [0402-B]
C14  100n  C0402-B  [0402-B]
C15  10n  C0402-B  [0402-B]
C16  10n  C0402-B  [0402-B]
C17  10n  C0402-B  [0402-B]
C18  10n  C0402-B  [0402-B]
C19  100n  C0402-B  [0402-B]
C20  100n  C0402-B  [0402-B]
C21  10n  C0402-B  [0402-B]
C22  10n  C0402-B  [0402-B]
C23  10n  C0402-B  [0402-B]
C24  10n  C0402-B  [0402-B]
C25  10n  C0402-B  [0402-B]
C26  10n  C0402-B  [0402-B]
C27  10n  C0402-B  [0402-B]
C28  100n  C0402-B  [0402-B]
HDR-NW  PINHD-2X08_2.00  [2X08M]
HDR-SW  PINHD-2X08_2.00  [2X08M]
R1  R0402-B  [0402-B]
R2  R0402-B  [0402-B]
U1  SST25VF020B  [SOIC127P600X175-8N]
U3  MCP23018QFN  [QFN50P400X400X80-25N]
U9  MACHXO2-100  [MACHXO2-100TQFP]

### Nets
!HOLD!_W: U1.7(!HOLD) U3.5(GPB5)
!WP!_W: U1.3(!WP) U3.2(GPB2)
A_SCL: U3.9(SCL) ; also sheet 4
A_SDA: U3.10(SDA) ; also sheet 4
BANK13_01_N [power]: U9.38(PB16A) ; also sheet 2
BANK13_01_P [power]: U9.39(PB16B) ; also sheet 2
C_CK_W: U9.18(PL11A) ; also sheet 4
C_EN_W: U9.14(PL9A) ; also sheet 4
C_SI_W: U9.19(PL11B) ; also sheet 4
C_SO_W: U9.15(PL9B) ; also sheet 4
DONE_W: U3.22(GPA7) U9.76(DONE)
GND: C13.2 C14.2 C15.2 C16.2 C17.2 C18.2 C19.2 C20.2 C21.2 C22.2 C23.2 C24.2 C25.2 C26.2 C27.2 C28.2 HDR-SW.11 HDR-SW.12 R2.2 U1.4(VSS) U3.23(VSS) U3.25(VSS) U9.6(GND) U9.22(GND) U9.33(GND) U9.44(GND) U9.56(GND) U9.72(GND) U9.79(GND) U9.92(GND) ; also sheet 1,3,4,6
INITN_W: U3.21(GPA6) U9.77(INITN)
JTAGENB_W: U3.19(GPA4) U9.82(JTAGENB)
N$9: U9.47(PB22B)
N$117: U9.45(PB22A)
N$196: U3.7(GPB7)
N$200: R1.2 R2.1 U3.11(ADDR)
PCIE_N_IO0: U9.84(PT19A) ; also sheet 4
PCIE_N_IO1: U9.83(PT19B) ; also sheet 4
PCIE_N_IO2: U9.75(PR1A) ; also sheet 4
PCIE_N_IO3: U9.74(PR1B) ; also sheet 4
PCIE_N_IO4: U9.71(PR3A) ; also sheet 4
PCIE_N_IO5: U9.70(PR3B) ; also sheet 4
PCIE_N_IO6: U9.69(PR4A) ; also sheet 4
PCIE_N_IO7: U9.68(PR4B) ; also sheet 4
PCIE_S_IO0: U9.1(PL2A) ; also sheet 4
PCIE_S_IO1: U9.2(PL2B) ; also sheet 4
PCIE_S_IO2: U9.98(PT9B) ; also sheet 4
PCIE_S_IO3: U9.99(PT9A) ; also sheet 4
PCIE_S_IO4: U9.96(PT11B) ; also sheet 4
PCIE_S_IO5: U9.97(PT11A) ; also sheet 4
PCIE_S_IO6: U9.88(PT17A) ; also sheet 4
PCIE_S_IO7: U9.87(PT17B) ; also sheet 4
PCIE_SCL: U9.86(SCL) ; also sheet 4
PCIE_SDA: U9.85(SDA) ; also sheet 4
PROGRAMN_W: U3.20(GPA5) U9.81(PROGRAMN)
S_SCK: U9.28(PB5B) ; also sheet 3
S_SCL: U9.34(PB11A) ; also sheet 3
S_SDA: U9.35(PB11B) ; also sheet 3
S_SDI: U9.30(PB6B) ; also sheet 3
S_SDO: U9.29(PB6A) ; also sheet 3
SCK_W: U1.6(SCK) U3.3(GPB3) U9.31(MCLK)
SDI_W: U1.5(SI) U3.1(GPB1) U9.49(SI/SISPI)
SDO_W: U1.2(SO) U3.4(GPB4) U9.32(SO/SPISO)
SH_NW_IO0: HDR-NW.1 U9.67(PR5A)
SH_NW_IO1: HDR-NW.2 U9.66(PR5B)
SH_NW_IO2: HDR-NW.3 U9.65(PR6A)
SH_NW_IO3: HDR-NW.4 U9.64(PR6B)
SH_NW_IO4: HDR-NW.5 U9.63(PR7A)
SH_NW_IO5: HDR-NW.6 U9.62(PR7B)
SH_NW_IO6: HDR-NW.7 U9.60(PR10A)
SH_NW_IO7: HDR-NW.8 U9.59(PR10B)
SH_NW_IO8: HDR-NW.9 U9.58(PR11A)
SH_NW_IO9: HDR-NW.10 U9.57(PR11B)
SH_NW_V1: C13.1 C14.1 C15.1 C16.1 C17.1 C18.1 HDR-NW.12 U1.8(VCC) U9.26(VCCIO2) U9.46(VCCIO2) U9.50(VCC) U9.100(VCC) ; also sheet 4
SH_NW_V2: C19.1 C20.1 C21.1 C22.1 C23.1 C24.1 C25.1 C26.1 C27.1 C28.1 HDR-NW.11 R1.1 U3.8(VDD) U3.12(!RESET) U9.5(VCCIO5) U9.11(VCCIO4) U9.23(VCCIO3) U9.55(VCCIO1) U9.73(VCCIO1) U9.80(VCCIO0) U9.93(VCCIO0) ; also sheet 4
SH_SW_IO0: HDR-SW.1 U9.4(PL3B)
SH_SW_IO1: HDR-SW.2 U9.3(PL3A)
SH_SW_IO2: HDR-SW.3 U9.8(PL4B)
SH_SW_IO3: HDR-SW.4 U9.7(PL4A)
SH_SW_IO4: HDR-SW.5 U9.10(PL5B)
SH_SW_IO5: HDR-SW.6 U9.9(PL5A)
SH_SW_IO6: HDR-SW.7 U9.12(PL7C)
SH_SW_IO7: HDR-SW.8 U9.13(PL7D)
SH_SW_IO8: HDR-SW.9 U9.16(PL10A)
SH_SW_IO9: HDR-SW.10 U9.17(PL10B)
SN_W: U3.24(GPB0) U9.48(SN)
SS_W: U1.1(!CE) U3.6(GPB6) U9.27(CSSPIN)
TCK: U9.43(PB21B) ; also sheet 3
TCK_W: U3.17(GPA2) U9.91(TCK)
TDI: U9.41(PB18B) ; also sheet 3
TDI_W: U3.16(GPA1) U9.94(TDI)
TDO: U9.40(PB18A) ; also sheet 3
TDO_W: U3.15(GPA0) U9.95(TDO)
TMS: U9.42(PB21A) ; also sheet 3
TMS_W: U3.18(GPA3) U9.90(TMS)
W_SCL: U9.36(PB12A) ; also sheet 3
W_SDA: U9.37(PB12B) ; also sheet 3
XX1_N: HDR-NW.16 U9.52(PR14A)
XX1_P: HDR-NW.15 U9.51(PR14B)
XX2_N: HDR-NW.14 U9.54(PR12A)
XX2_P: HDR-NW.13 U9.53(PR12B)
XX3_N: HDR-SW.16 U9.25(PL14B)
XX3_P: HDR-SW.15 U9.24(PL14A)
XX4_N: HDR-SW.14 U9.21(PL12B)
XX4_P: HDR-SW.13 U9.20(PL12A)
Unconnected: U3.13(INTB) U3.14(INTA) U9.61(PR9A) U9.78(PT22A) U9.89(NC)

### Notes on the sheet
- AXIOM Beta Main Board [Test]
- Interface Fabric West
- Copyright (C) 2015 H.Poetzl
  Licensed under CERN OHL v.1.2

## Sheet 6 of 6
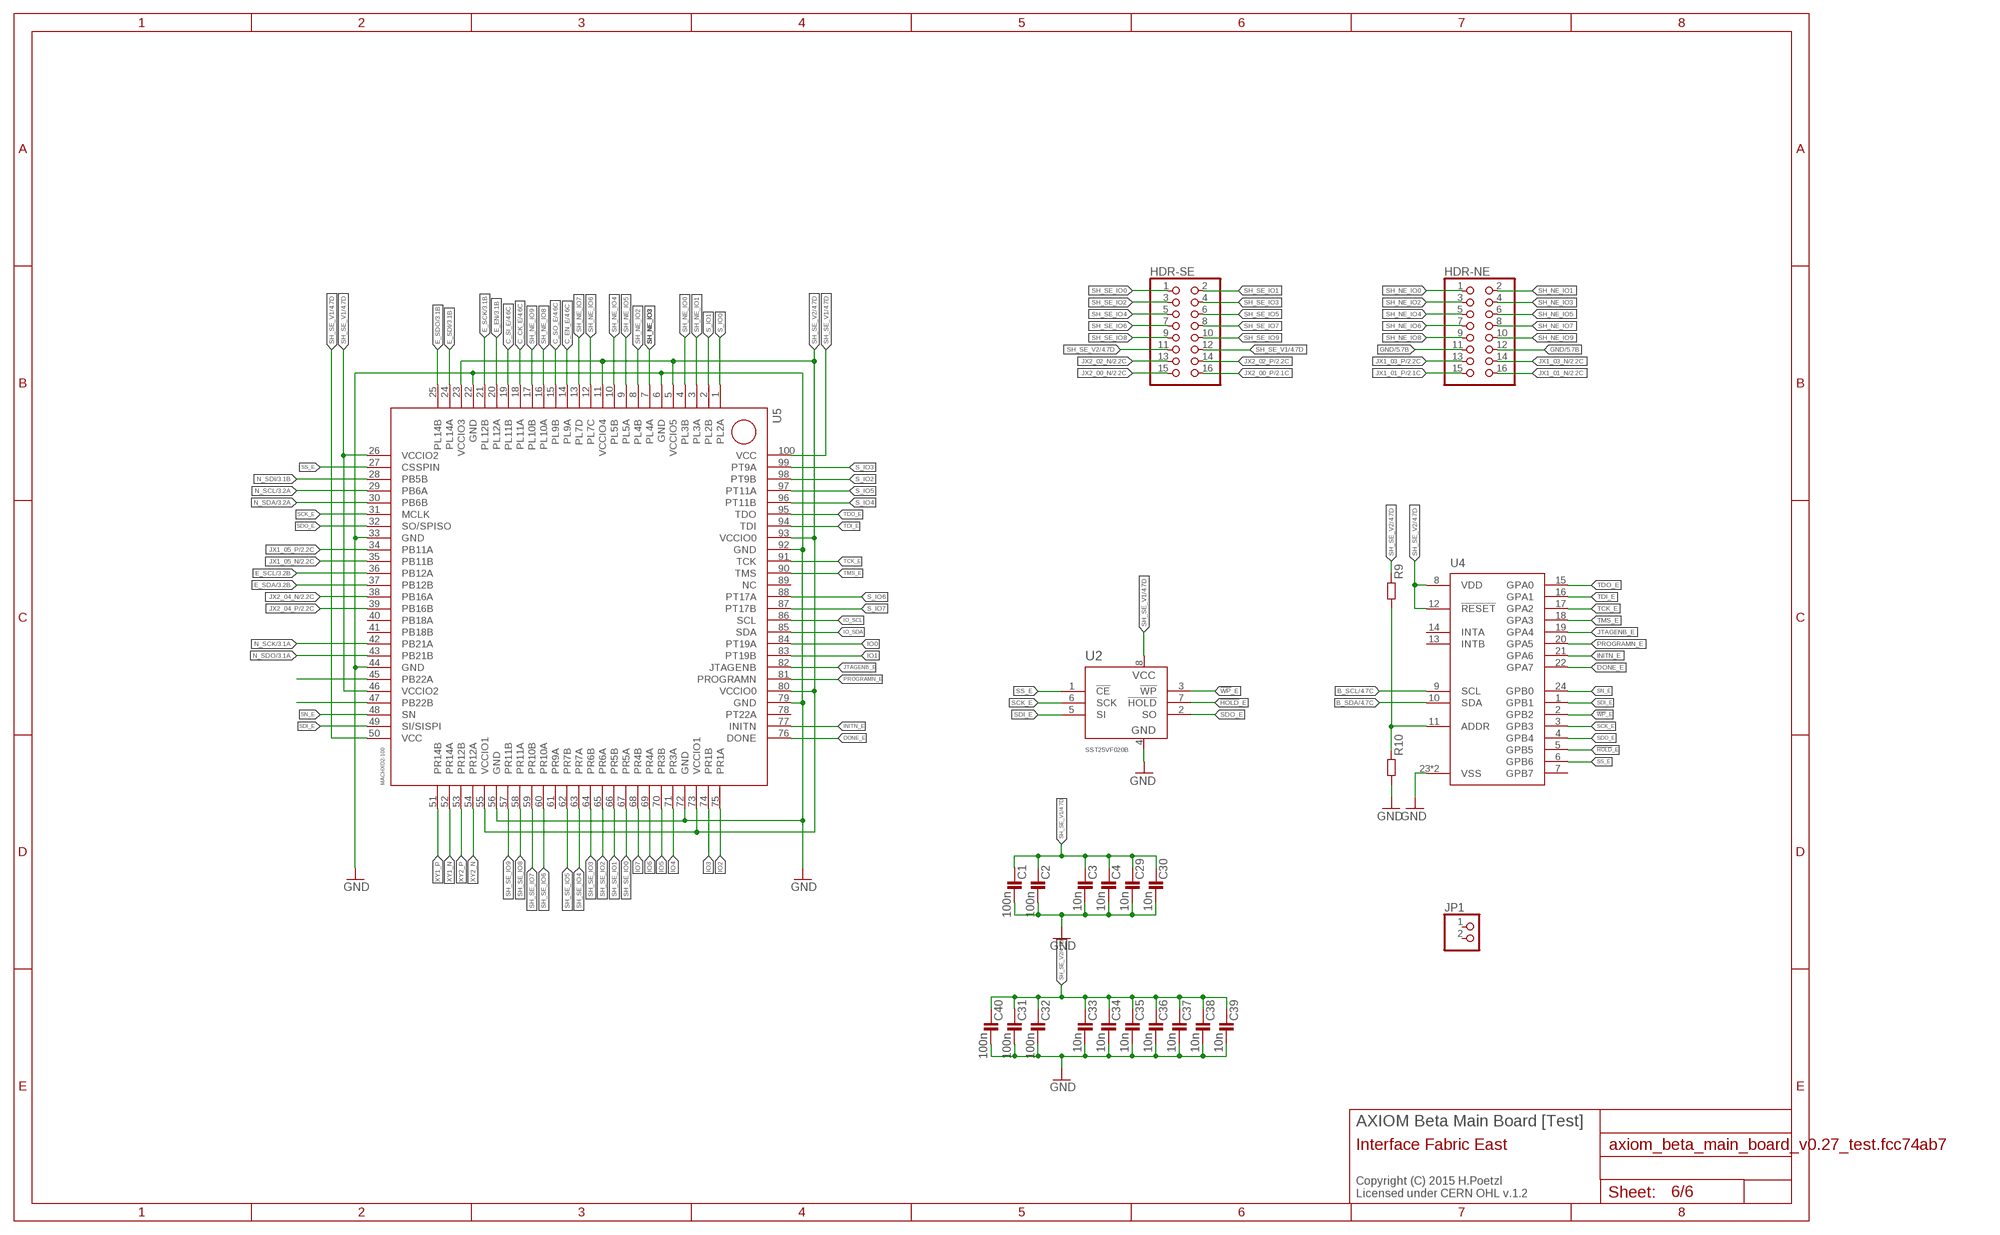
[diagram p5: schematic, sheet 6]

### Parts
C1  100n  C0402-B  [0402-B]
C2  100n  C0402-B  [0402-B]
C3  10n  C0402-B  [0402-B]
C4  10n  C0402-B  [0402-B]
C29  10n  C0402-B  [0402-B]
C30  10n  C0402-B  [0402-B]
C31  100n  C0402-B  [0402-B]
C32  100n  C0402-B  [0402-B]
C33  10n  C0402-B  [0402-B]
C34  10n  C0402-B  [0402-B]
C35  10n  C0402-B  [0402-B]
C36  10n  C0402-B  [0402-B]
C37  10n  C0402-B  [0402-B]
C38  10n  C0402-B  [0402-B]
C39  10n  C0402-B  [0402-B]
C40  100n  C0402-B  [0402-B]
HDR-NE  PINHD-2X08_2.00  [2X08M]
HDR-SE  PINHD-2X08_2.00  [2X08M]
JP1  PINHD-1X02_2.00  [1X02M]
R9  R0402-B  [0402-B]
R10  R0402-B  [0402-B]
U2  SST25VF020B  [SOIC127P600X175-8N]
U4  MCP23018QFN  [QFN50P400X400X80-25N]
U5  MACHXO2-100  [MACHXO2-100TQFP]

### Nets
!HOLD!_E: U2.7(!HOLD) U4.5(GPB5)
!WP!_E: U2.3(!WP) U4.2(GPB2)
B_SCL: U4.9(SCL) ; also sheet 4
B_SDA: U4.10(SDA) ; also sheet 4
C_CK_E: U5.18(PL11A) ; also sheet 4
C_EN_E: U5.14(PL9A) ; also sheet 4
C_SI_E: U5.19(PL11B) ; also sheet 4
C_SO_E: U5.15(PL9B) ; also sheet 4
DONE_E: U4.22(GPA7) U5.76(DONE)
E_EN: U5.20(PL12A) ; also sheet 3
E_SCK: U5.21(PL12B) ; also sheet 3
E_SCL: U5.36(PB12A) ; also sheet 3
E_SDA: U5.37(PB12B) ; also sheet 3
E_SDI: U5.24(PL14A) ; also sheet 3
E_SDO: U5.25(PL14B) ; also sheet 3
GND: C1.2 C2.2 C3.2 C4.2 C29.2 C30.2 C31.2 C32.2 C33.2 C34.2 C35.2 C36.2 C37.2 C38.2 C39.2 C40.2 HDR-NE.11 HDR-NE.12 R10.2 U2.4(VSS) U4.23(VSS) U4.25(VSS) U5.6(GND) U5.22(GND) U5.33(GND) U5.44(GND) U5.56(GND) U5.72(GND) U5.79(GND) U5.92(GND) ; also sheet 1,3,4,5
INITN_E: U4.21(GPA6) U5.77(INITN)
IO0: U5.84(PT19A)
IO1: U5.83(PT19B)
IO2: U5.75(PR1A)
IO3: U5.74(PR1B)
IO4: U5.71(PR3A)
IO5: U5.70(PR3B)
IO6: U5.69(PR4A)
IO7: U5.68(PR4B)
IO_SCL: U5.86(SCL)
IO_SDA: U5.85(SDA)
JTAGENB_E: U4.19(GPA4) U5.82(JTAGENB)
JX1_01_N [power]: HDR-NE.16 ; also sheet 2
JX1_01_P [power]: HDR-NE.15 ; also sheet 2
JX1_03_N [power]: HDR-NE.14 ; also sheet 2
JX1_03_P [power]: HDR-NE.13 ; also sheet 2
JX1_05_N: U5.35(PB11B) ; also sheet 2
JX1_05_P: U5.34(PB11A) ; also sheet 2
JX2_00_N [power]: HDR-SE.15 ; also sheet 2
JX2_00_P [power]: HDR-SE.16 ; also sheet 2
JX2_02_N [power]: HDR-SE.13 ; also sheet 2
JX2_02_P [power]: HDR-SE.14 ; also sheet 2
JX2_04_N [power]: U5.38(PB16A) ; also sheet 2
JX2_04_P [power]: U5.39(PB16B) ; also sheet 2
N$107: R9.2 R10.1 U4.11(ADDR)
N$116: U5.47(PB22B)
N$166: U5.45(PB22A)
N_SCK: U5.42(PB21A) ; also sheet 3
N_SCL: U5.29(PB6A) ; also sheet 3
N_SDA: U5.30(PB6B) ; also sheet 3
N_SDI: U5.28(PB5B) ; also sheet 3
N_SDO: U5.43(PB21B) ; also sheet 3
PROGRAMN_E: U4.20(GPA5) U5.81(PROGRAMN)
S_IO0: U5.1(PL2A)
S_IO1: U5.2(PL2B)
S_IO2: U5.98(PT9B)
S_IO3: U5.99(PT9A)
S_IO4: U5.96(PT11B)
S_IO5: U5.97(PT11A)
S_IO6: U5.88(PT17A)
S_IO7: U5.87(PT17B)
SCK_E: U2.6(SCK) U4.3(GPB3) U5.31(MCLK)
SDI_E: U2.5(SI) U4.1(GPB1) U5.49(SI/SISPI)
SDO_E: U2.2(SO) U4.4(GPB4) U5.32(SO/SPISO)
SH_NE_IO0: HDR-NE.1 U5.4(PL3B)
SH_NE_IO1: HDR-NE.2 U5.3(PL3A)
SH_NE_IO2: HDR-NE.3 U5.8(PL4B)
SH_NE_IO3: HDR-NE.4 U5.7(PL4A)
SH_NE_IO4: HDR-NE.5 U5.10(PL5B)
SH_NE_IO5: HDR-NE.6 U5.9(PL5A)
SH_NE_IO6: HDR-NE.7 U5.12(PL7C)
SH_NE_IO7: HDR-NE.8 U5.13(PL7D)
SH_NE_IO8: HDR-NE.9 U5.16(PL10A)
SH_NE_IO9: HDR-NE.10 U5.17(PL10B)
SH_SE_IO0: HDR-SE.1 U5.67(PR5A)
SH_SE_IO1: HDR-SE.2 U5.66(PR5B)
SH_SE_IO2: HDR-SE.3 U5.65(PR6A)
SH_SE_IO3: HDR-SE.4 U5.64(PR6B)
SH_SE_IO4: HDR-SE.5 U5.63(PR7A)
SH_SE_IO5: HDR-SE.6 U5.62(PR7B)
SH_SE_IO6: HDR-SE.7 U5.60(PR10A)
SH_SE_IO7: HDR-SE.8 U5.59(PR10B)
SH_SE_IO8: HDR-SE.9 U5.58(PR11A)
SH_SE_IO9: HDR-SE.10 U5.57(PR11B)
SH_SE_V1: C1.1 C2.1 C3.1 C4.1 C29.1 C30.1 HDR-SE.12 U2.8(VCC) U5.26(VCCIO2) U5.46(VCCIO2) U5.50(VCC) U5.100(VCC) ; also sheet 4
SH_SE_V2: C31.1 C32.1 C33.1 C34.1 C35.1 C36.1 C37.1 C38.1 C39.1 C40.1 HDR-SE.11 R9.1 U4.8(VDD) U4.12(!RESET) U5.5(VCCIO5) U5.11(VCCIO4) U5.23(VCCIO3) U5.55(VCCIO1) U5.73(VCCIO1) U5.80(VCCIO0) U5.93(VCCIO0) ; also sheet 4
SN_E: U4.24(GPB0) U5.48(SN)
SS_E: U2.1(!CE) U4.6(GPB6) U5.27(CSSPIN)
TCK_E: U4.17(GPA2) U5.91(TCK)
TDI_E: U4.16(GPA1) U5.94(TDI)
TDO_E: U4.15(GPA0) U5.95(TDO)
TMS_E: U4.18(GPA3) U5.90(TMS)
XY1_N: U5.52(PR14A)
XY1_P: U5.51(PR14B)
XY2_N: U5.54(PR12A)
XY2_P: U5.53(PR12B)
Unconnected: JP1.1 JP1.2 U4.7(GPB7) U4.13(INTB) U4.14(INTA) U5.40(PB18A) U5.41(PB18B) U5.61(PR9A) U5.78(PT22A) U5.89(NC)

### Notes on the sheet
- AXIOM Beta Main Board [Test]
- Interface Fabric East
- Copyright (C) 2015 H.Poetzl
  Licensed under CERN OHL v.1.2

## Power pins joined to a net without a drawn wire
VCCO_34: ZED1.78(_POWER:VCCO_34)
VCCO_35: ZED1.178(_POWER:VCCO_35)

## Library data of the parts
C1-C5 C5' C6 C6' C7 C7' C8 C8' C9 C9' C10 C10' C11 C11' C12 C12' C13-C40 = generic-rcl:C
HDR-NE HDR-NW HDR-SE HDR-SW = pincon:PINHD-2X08: PIN HEADER
JP1 = pinhead-2:PINHD-1X02: PIN HEADER
PB-NW PB-SE = df12:DF12(XX)-20DP-0.5V
PCIE-NORTH PCIE-SOUTH = PCIe:PCIE-36-AXIOM
PWR-NE PWR-NW PWR-SE PWR-SW = pincon:PINHD-2X02
R1-R10 = generic-rcl:R
U1 U2 = flash:SST25VF020B
U3 U4 = microchip-exp:MCP23018: http://ww1.microchip.com/downloads/en/DeviceDoc/22103a.pdf Source: http://ww1.microchip.com/downloads/en/DeviceDoc/22103a.pdf Adopted by RobG
U5 U9 = machxo2:MACHXO2-100: IC, High-Performance,General Purpose and USB,32-bit Flash Microcontrollers,100-Lead TQFP
U6 = pca9540:PCA9540: IC,2-channel I²C-bus multiplexer, 8TSSOP; MPN: PCA9540BDP; OC_FARNELL: 2212116; OC_NEWARK: 55W4318; PACKAGE: TSSOP8; SUPPLIER: NXP
U$1-U$4 U$11 U$14-U$22 = pinpad:PINPAD
X-EAST X-WEST = fx10:FX10-100/10
ZED1 = microzed:µZ-FCI

## Net classes
0 default: width 0.152 mm, drill 0.254 mm
1 power: width 0.152 mm, drill 0.254 mm